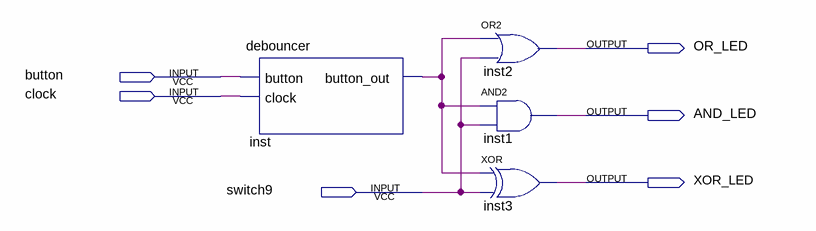
[diagram p0: schematic sheet]
// Quartus schematic lab2.bdf as structural Verilog: 4 symbols, 6 pins
module lab2 (
  input  button,
  input  clock,
  input  switch9,
  output OR_LED,
  output AND_LED,
  output XOR_LED
);

  wire inst_button_out;

  debouncer inst (.button(button), .clock(clock), .button_out(inst_button_out));
  or inst2 (OR_LED, inst_button_out, switch9);
  and inst1 (AND_LED, inst_button_out, switch9);
  xor inst3 (XOR_LED, inst_button_out, switch9);
endmodule
